# Altium schematic sheet 1.PMIC_1.SchDoc
size A3; SheetNumber: 1; SheetTotal: 21
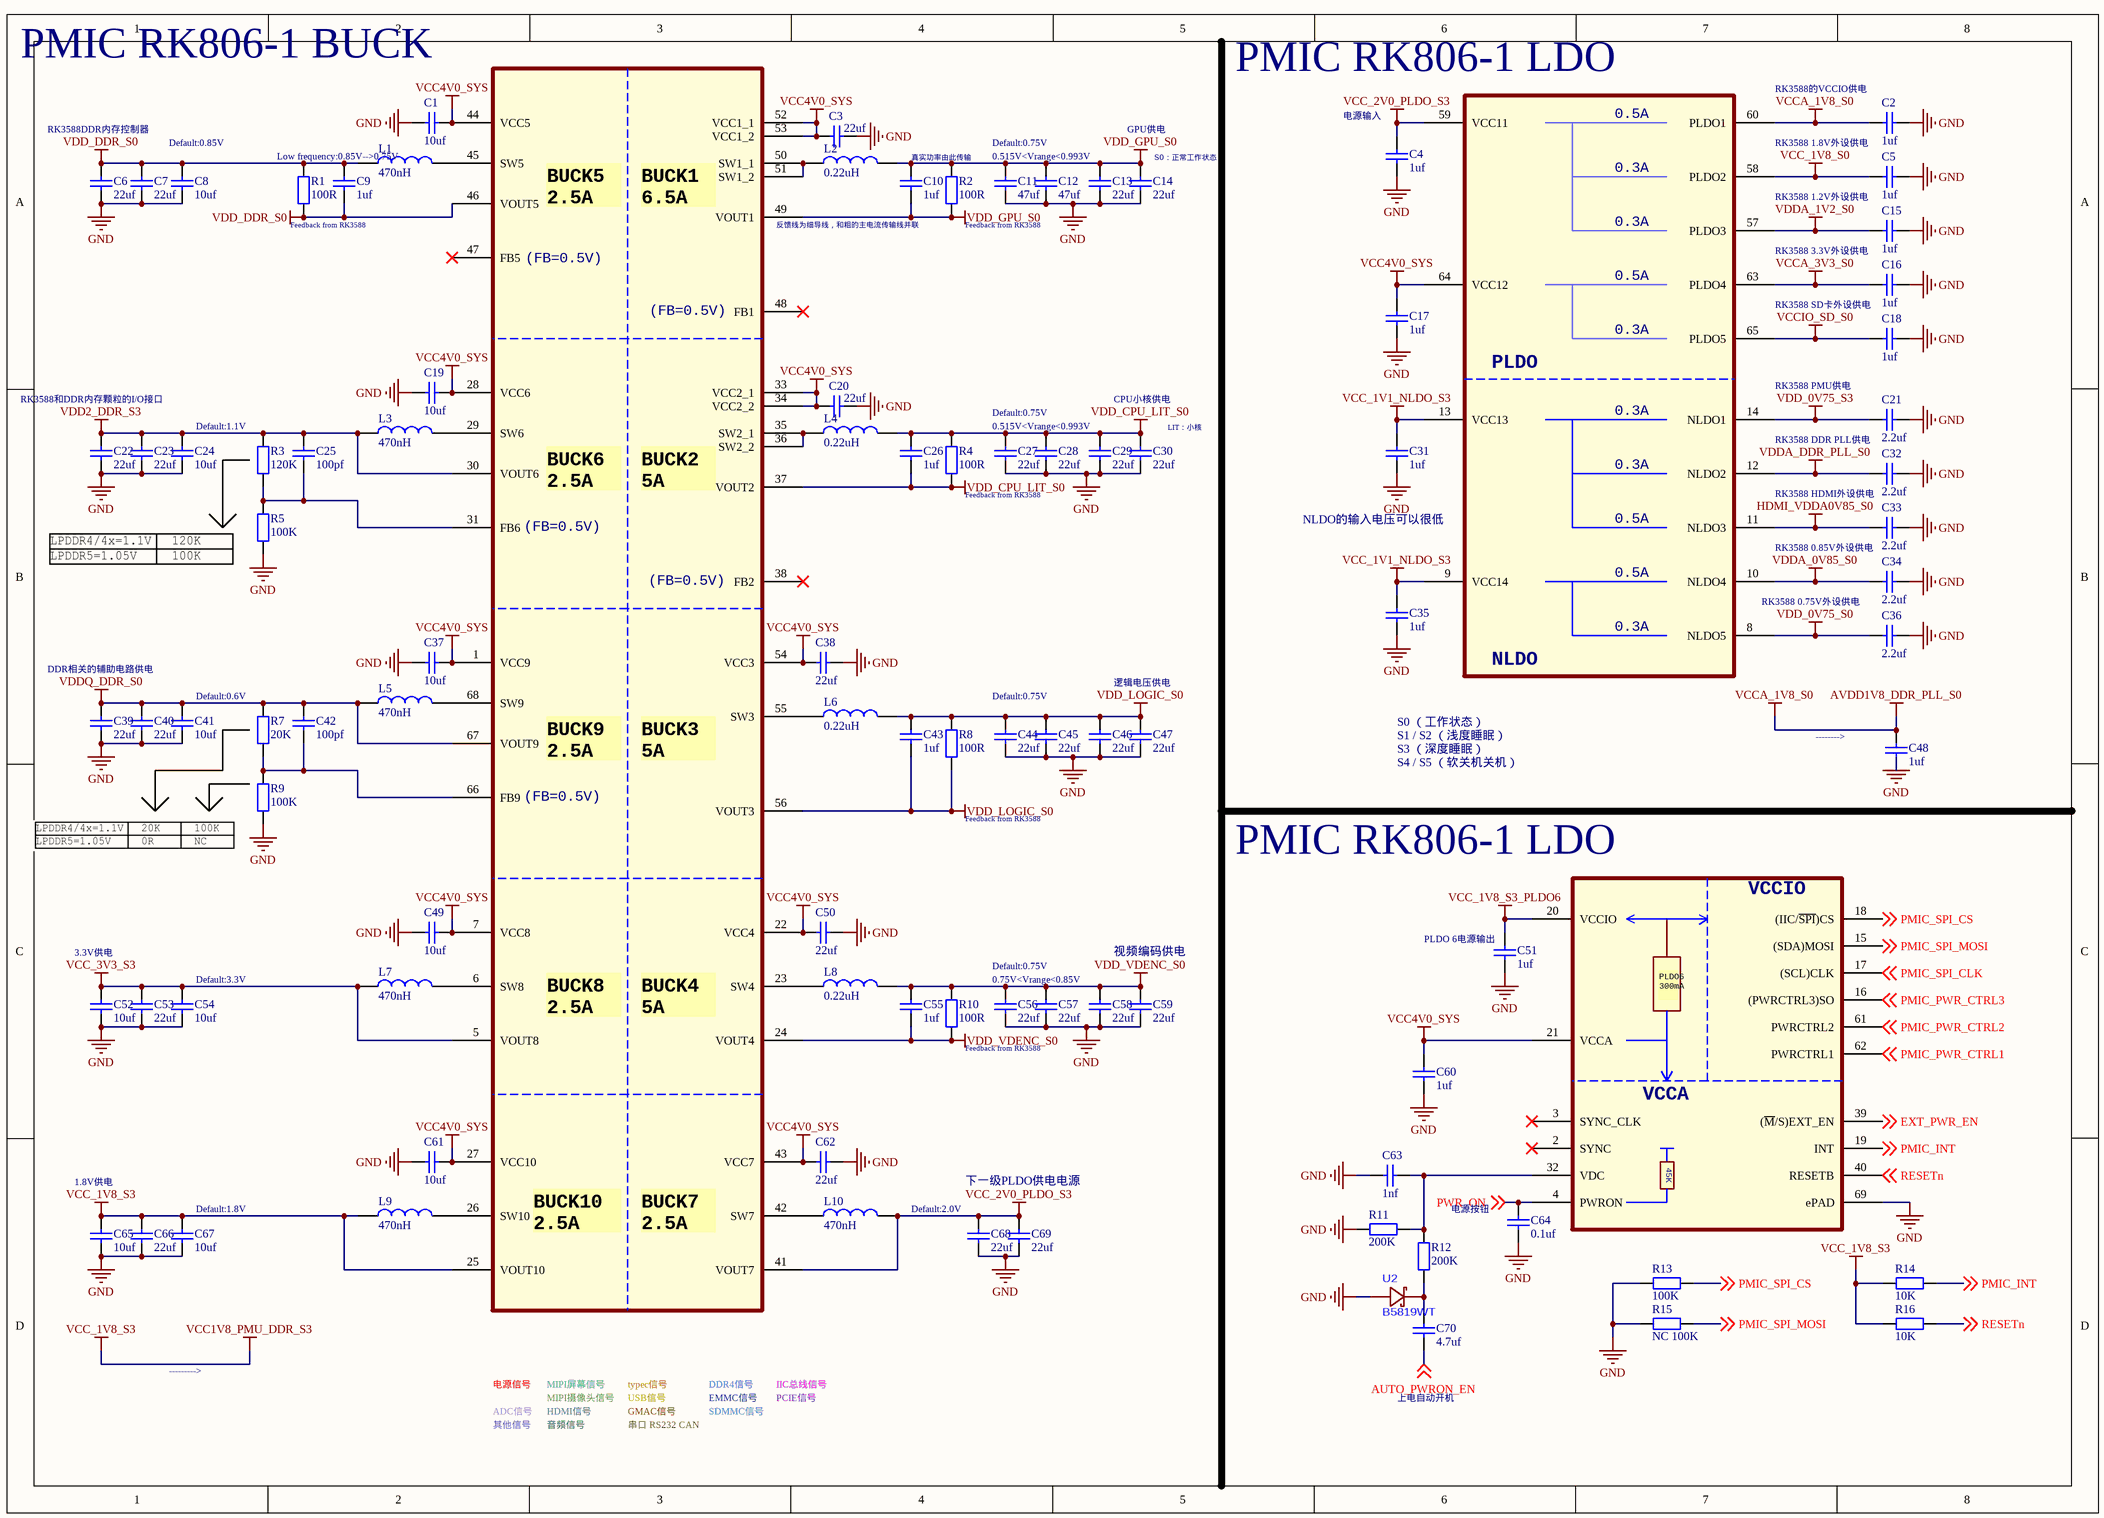
[diagram p0: 1.PMIC_1.SchDoc]

## Parts
C1  10uf  [C0603_L]
C2  1uf  [C0402_L]
C3  22uf  [C0603_L]
C4  1uf  [C0402_L]
C5  1uf  [C0402_L]
C6  22uf  [C0603_L]
C7  22uf  [C0603_L]
C8  10uf  [C0402_L]
C9  1uf  [C0402_L]
C10  1uf  [C0402_L]
C11  47uf  [C0805_L]
C12  47uf  [C0805_L]
C13  22uf  [C0603_L]
C14  22uf  [C0603_L]
C15  1uf  [C0402_L]
C16  1uf  [C0402_L]
C17  1uf  [C0402_L]
C18  1uf  [C0402_L]
C19  10uf  [C0603_L]
C20  22uf  [C0603_L]
C21  2.2uf  [C0402_L]
C22  22uf  [C0603_L]
C23  22uf  [C0603_L]
C24  10uf  [C0402_L]
C25  100pf  [C0402_L]
C26  1uf  [C0402_L]
C27  22uf  [C0603_L]
C28  22uf  [C0603_L]
C29  22uf  [C0603_L]
C30  22uf  [C0603_L]
C31  1uf  [C0402_L]
C32  2.2uf  [C0402_L]
C33  2.2uf  [C0402_L]
C34  2.2uf  [C0402_L]
C35  1uf  [C0402_L]
C36  2.2uf  [C0402_L]
C37  10uf  [C0603_L]
C38  22uf  [C0603_L]
C39  22uf  [C0603_L]
C40  22uf  [C0603_L]
C41  10uf  [C0402_L]
C42  100pf  [C0402_L]
C43  1uf  [C0402_L]
C44  22uf  [C0805_L]
C45  22uf  [C0805_L]
C46  22uf  [C0603_L]
C47  22uf  [C0603_L]
C48  1uf  [C0402_L]
C49  10uf  [C0603_L]
C50  22uf  [C0603_L]
C51  1uf  [C0402_L]
C52  10uf  [C0603_L]
C53  22uf  [C0603_L]
C54  10uf  [C0402_L]
C55  1uf  [C0402_L]
C56  22uf  [C0805_L]
C57  22uf  [C0805_L]
C58  22uf  [C0603_L]
C59  22uf  [C0603_L]
C60  1uf  [C0402_L]
C61  10uf  [C0603_L]
C62  22uf  [C0603_L]
C63  1nf  [C0402_L]
C64  0.1uf  [C0402_L]
C65  10uf  [C0603_L]
C66  22uf  [C0603_L]
C67  10uf  [C0402_L]
C68  22uf  [C0603_L]
C69  22uf  [C0603_L]
C70  4.7uf  [C0402_L]
L1  470nH  [L0805]
L2  0.22uH  [L0805]
L3  470nH  [L0805]
L4  0.22uH  [L0805]
L5  470nH  [L0805]
L6  0.22uH  [L0805]
L7  470nH  [L0805]
L8  0.22uH  [L0805]
L9  470nH  [L0805]
L10  470nH  [L0805]
R1  100R  [R0402_L]
R2  100R  [R0402_L]
R3  120K  [R0402_L]
R4  100R  [R0402_L]
R5  100K  [R0402_L]
R7  20K  [R0402_L]
R8  100R  [R0402_L]
R9  100K  [R0402_L]
R10  100R  [R0402_L]
R11  200K  [R0402_L]
R12  200K  [R0402_L]
R13  100K  [R0402_L]
R14  10K  [R0402_L]
R15  NC 100K  [R0402_L]
R16  10K  [R0402_L]
U1  PMIC_RK806  [QFN68_7R00X7R00X0R80_T]  (value not drawn)  (parts A,B,C of 3)
U2  B5819WT  [SOD-523_L1.2-W0.8-LS1.6-RD]

## Nets
AVDD1V8_DDR_PLL_S0: C2.2 C48.1 U1.60(PLDO1)  [also labelled VCCA_1V8_S0]
GND: C1.2 C2.1 C3.2 C4.1 C5.1 C6.1 C7.1 C8.1 C11.1 C12.1 C13.1 C14.1 C15.1 C16.1 C17.1 C18.1 C19.2 C20.2 C21.1 C22.1 C23.1 C24.1 C27.1 C28.1 C29.1 C30.1 C31.1 C32.1 C33.1 C34.1 C35.1 C36.1 C37.2 C38.2 C39.1 C40.1 C41.1 C44.1 C45.1 C46.1 C47.1 C48.2 C49.2 C50.2 C51.1 C52.1 C53.1 C54.1 C56.1 C57.1 C58.1 C59.1 C60.1 C61.2 C62.2 C63.1 C64.1 C65.1 C66.1 C67.1 C68.1 C69.1 R5.1 R9.1 R11.1 R13.1 R15.1 U1.69(ePAD) U2.2(A)
HDMI_VDDA0V85_S0: C33.2 U1.11(NLDO3)
VCC1V8_PMU_DDR_S3: C65.2 C66.2 C67.2 L9.2 R14.1 R16.1 U1.25(VOUT10)  [also labelled VCC_1V8_S3]
VCC4V0_SYS: C1.1 C3.1 C17.2 C19.1 C20.1 C37.1 C38.1 C49.1 C50.1 C60.2 C61.1 C62.1 U1.1(VCC9) U1.7(VCC8) U1.21(VCCA) U1.22(VCC4) U1.27(VCC10) U1.28(VCC6) U1.33(VCC2_1) U1.34(VCC2_2) U1.43(VCC7) U1.44(VCC5) U1.52(VCC1_1) U1.53(VCC1_2) U1.54(VCC3) U1.64(VCC12)
VCC_1V1_NLDO_S3: C31.2 C35.2 U1.9(VCC14) U1.13(VCC13)
VCC_1V8_S0: C5.2 U1.58(PLDO2)
VCC_1V8_S3_PLDO6: C51.2 U1.20(VCCIO)
VCC_2V0_PLDO_S3: C4.2 C68.2 C69.2 L10.2 U1.41(VOUT7) U1.59(VCC11)
VCC_3V3_S3: C52.2 C53.2 C54.2 L7.2 U1.5(VOUT8)
VCCA_3V3_S0: C16.2 U1.63(PLDO4)
VCCIO_SD_S0: C18.2 U1.65(PLDO5)
VDD2_DDR_S3: C22.2 C23.2 C24.2 C25.2 L3.2 R3.2 U1.30(VOUT6)
VDD_0V75_S0: C36.2 U1.8(NLDO5)
VDD_0V75_S3: C21.2 U1.14(NLDO1)
VDD_CPU_LIT_S0: C26.1 C26.2 C27.2 C28.2 C29.2 C30.2 L4.2 R4.1 R4.2 U1.37(VOUT2)
VDD_DDR_S0: C6.2 C7.2 C8.2 C9.1 C9.2 L1.2 R1.1 R1.2 U1.46(VOUT5)
VDD_GPU_S0: C10.1 C10.2 C11.2 C12.2 C13.2 C14.2 L2.2 R2.1 R2.2 U1.49(VOUT1)
VDD_LOGIC_S0: C43.1 C43.2 C44.2 C45.2 C46.2 C47.2 L6.2 R8.1 R8.2 U1.56(VOUT3)
VDD_VDENC_S0: C55.1 C55.2 C56.2 C57.2 C58.2 C59.2 L8.2 R10.1 R10.2 U1.24(VOUT4)
VDDA_0V85_S0: C34.2 U1.10(NLDO4)
VDDA_1V2_S0: C15.2 U1.57(PLDO3)
VDDA_DDR_PLL_S0: C32.2 U1.12(NLDO2)
VDDQ_DDR_S0: C39.2 C40.2 C41.2 C42.2 L5.2 R7.2 U1.67(VOUT9)
AUTO_PWRON_EN: C70.2 ; off-sheet AUTO_PWRON_EN
EXT_PWR_EN: U1.39((~{M}/S)EXT_EN) ; off-sheet EXT_PWR_EN
PMIC_INT: R14.2 U1.19(INT) ; off-sheet PMIC_INT
PMIC_PWR_CTRL1: U1.62(PWRCTRL1) ; off-sheet PMIC_PWR_CTRL1
PMIC_PWR_CTRL2: U1.61(PWRCTRL2) ; off-sheet PMIC_PWR_CTRL2
PMIC_PWR_CTRL3: U1.16((PWRCTRL3)SO) ; off-sheet PMIC_PWR_CTRL3
PMIC_SPI_CLK: U1.17((SCL)CLK) ; off-sheet PMIC_SPI_CLK
PMIC_SPI_CS: R13.2 U1.18((IIC/~{SPI})CS) ; off-sheet PMIC_SPI_CS
PMIC_SPI_MOSI: R15.2 U1.15((SDA)MOSI) ; off-sheet PMIC_SPI_MOSI
PWR_ON: C64.2 U1.4(PWRON) ; off-sheet PWR_ON
RESETn: R16.2 U1.40(RESETB) ; off-sheet RESETn
NetC25_1: C25.1 R3.1 R5.2 U1.31(FB6)
NetC42_1: C42.1 R7.1 R9.2 U1.66(FB9)
NetC63_2: C63.2 R11.2 R12.2 U1.32(VDC)
NetC70_1: C70.1 R12.1 U2.1(C)
NetL1_1: L1.1 U1.45(SW5)
NetL2_1: L2.1 U1.50(SW1_1) U1.51(SW1_2)
NetL3_1: L3.1 U1.29(SW6)
NetL4_1: L4.1 U1.35(SW2_1) U1.36(SW2_2)
NetL5_1: L5.1 U1.68(SW9)
NetL6_1: L6.1 U1.55(SW3)
NetL7_1: L7.1 U1.6(SW8)
NetL8_1: L8.1 U1.23(SW4)
NetL9_1: L9.1 U1.26(SW10)
NetL10_1: L10.1 U1.42(SW7)

Not connected (* = marked no-connect by the designer): U1 2(SYNC)* 3(SYNC_CLK)* 38(FB2)* 47(FB5)* 48(FB1)*

## Notes on the sheet
- PMIC RK806-1 BUCK
- (near U1) PMIC RK806-1 LDO
- (near C4) 电源输入
- RK3588的VCCIO供电
- RK3588DDR内存控制器
- Default:0.85V
- Low frequency:0.85V-->0.75V
- 真实功率由此传输
- Default:0.75V
- 0.515V<Vrange<0.993V
- GPU供电
- (near C14) S0​：正常工作状态
- RK3588 1.8V外设供电
- (near R1) Feedback from RK3588
- (near U1) 反馈线为细导线，和粗的主电流传输线并联
- Feedback from RK3588
- RK3588 1.2V外设供电
- RK3588 3.3V外设供电
- RK3588 SD卡外设供电
- RK3588 PMU供电
- RK3588和DDR内存颗粒的I/O接口
- Default:1.1V
- CPU小核供电
- (near C30) LIT：小核
- RK3588 DDR PLL供电
- NLDO的输入电压可以很低
- RK3588 HDMI外设供电
- RK3588 0.85V外设供电
- (near U1) RK3588 0.75V外设供电
- DDR相关的辅助电路供电
- Default:0.6V
- 逻辑电压供电
- S0 （工作状态）
- S1 / S2 （浅度睡眠）
- S3 （深度睡眠）
- S4 / S5 （软关机关机）
- (near C48) -------->
- PMIC RK806-1 LDO
- 3.3V供电
- (near C54) Default:3.3V
- 0.75V<Vrange<0.85V
- 视频编码供电
- (near C51) PLDO 6电源输出
- 1.8V供电
- 下一级PLDO供电电源
- (near C67) Default:1.8V
- (near C68) Default:2.0V
- 电源按钮
- --------->
- 电源信号
- MIPI屏幕信号
- MIPI摄像头信号
- typec信号
- USB信号
- DDR4信号
- EMMC信号
- PCIE信号
- IIC总线信号
- 上电自动开机
- 其他信号
- ADC信号
- 音频信号
- HDMI信号
- 串口 RS232 CAN
- GMAC信号
- SDMMC信号
- (in symbol PMIC_RK806, part A) BUCK5 / 2.5A; BUCK1 / 6.5A; (FB=0.5V); BUCK6 / 2.5A; BUCK2 / 5A; BUCK9 / 2.5A; BUCK3 / 5A; BUCK8 / 2.5A; BUCK4 / 5A; BUCK10 / 2.5A; BUCK7 / 2.5A
- (in symbol PMIC_RK806, part B) 0.5A; 0.3A; PLDO; NLDO
- (in symbol PMIC_RK806, part C) PLDO6 / 300mA; 45K

## Library data of the parts
C1-C70 = C: 贴片电容/MLCC电容
L1-L10 = L: 贴片小功率电感
R1-R5 R7-R16 = R: 贴片电阻